# Altium schematic sheet BSPD+SDC.SchDoc (part 1 of 3)
size A0
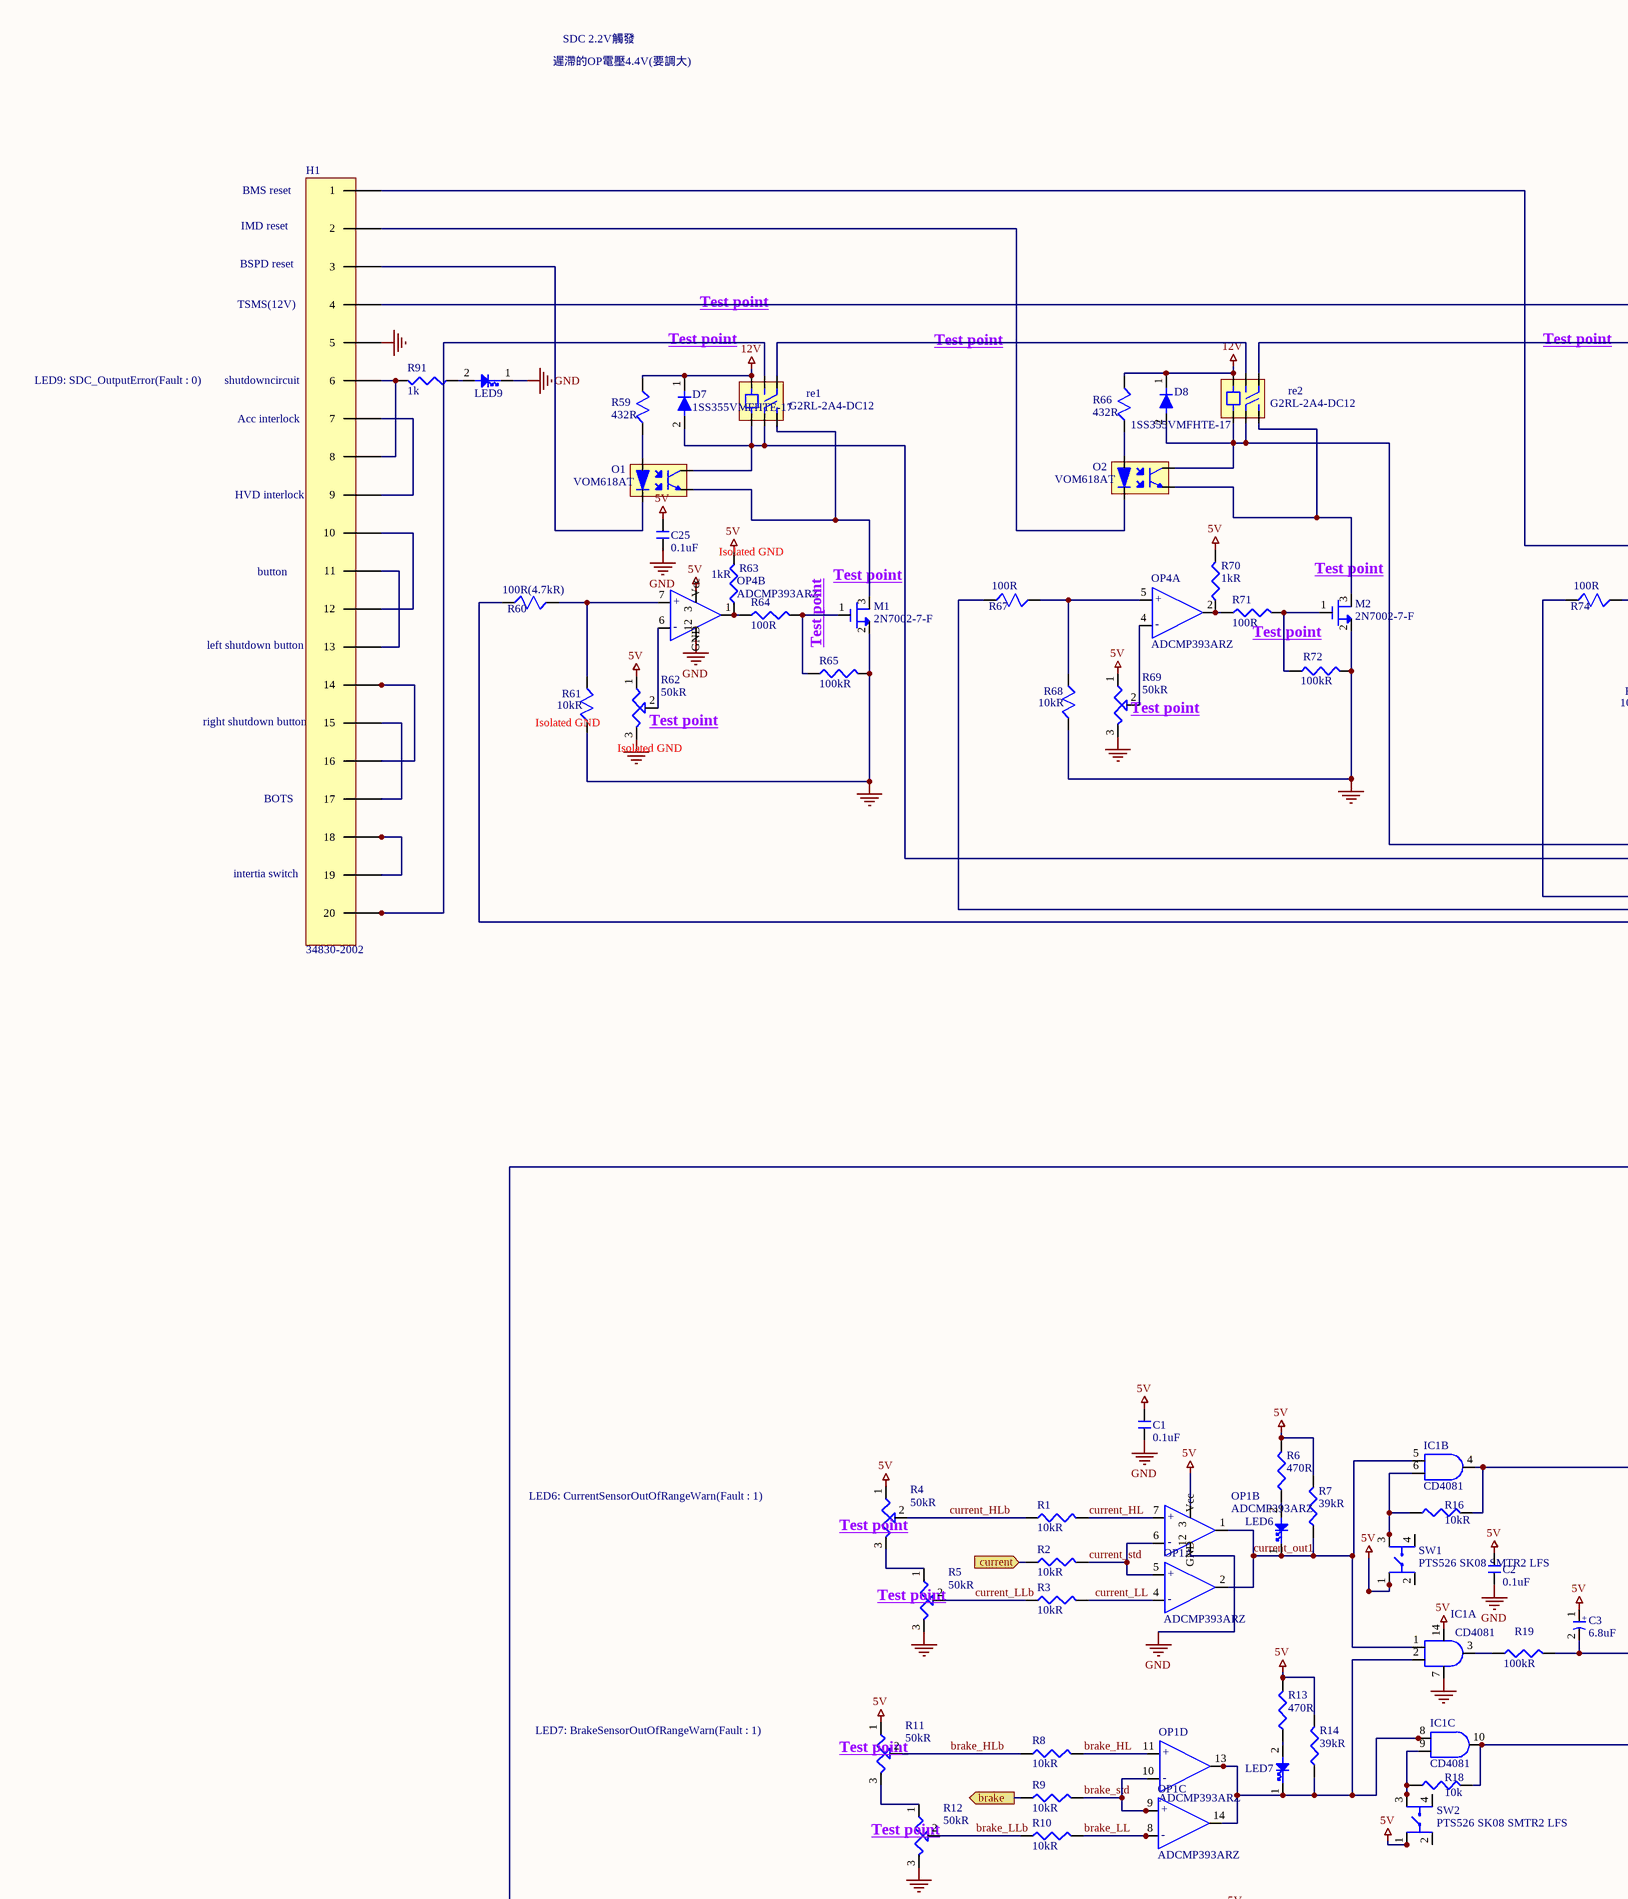
[diagram p0: BSPD+SDC.SchDoc, top left]
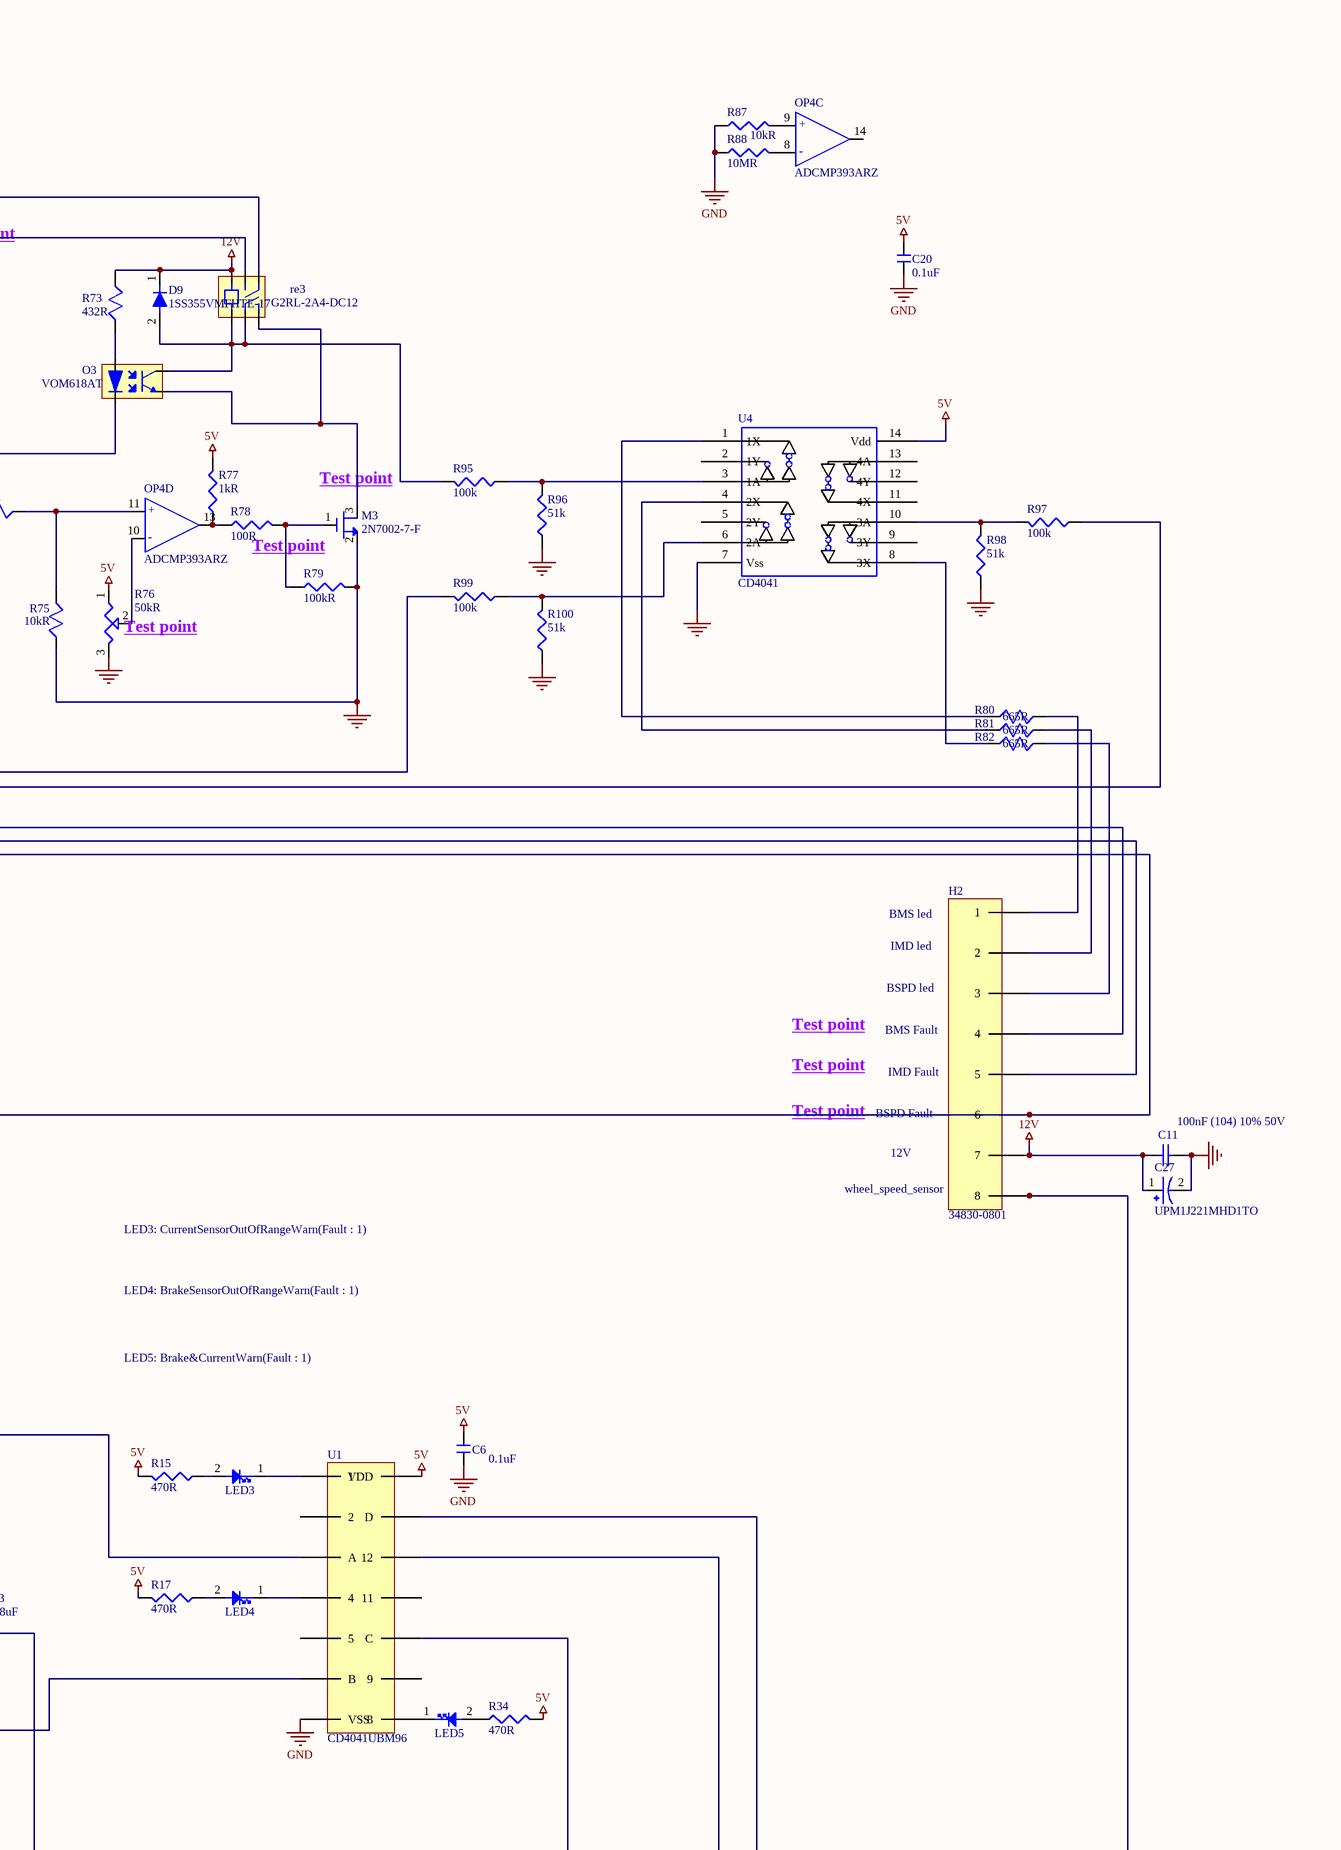
[diagram p1: BSPD+SDC.SchDoc, top right]
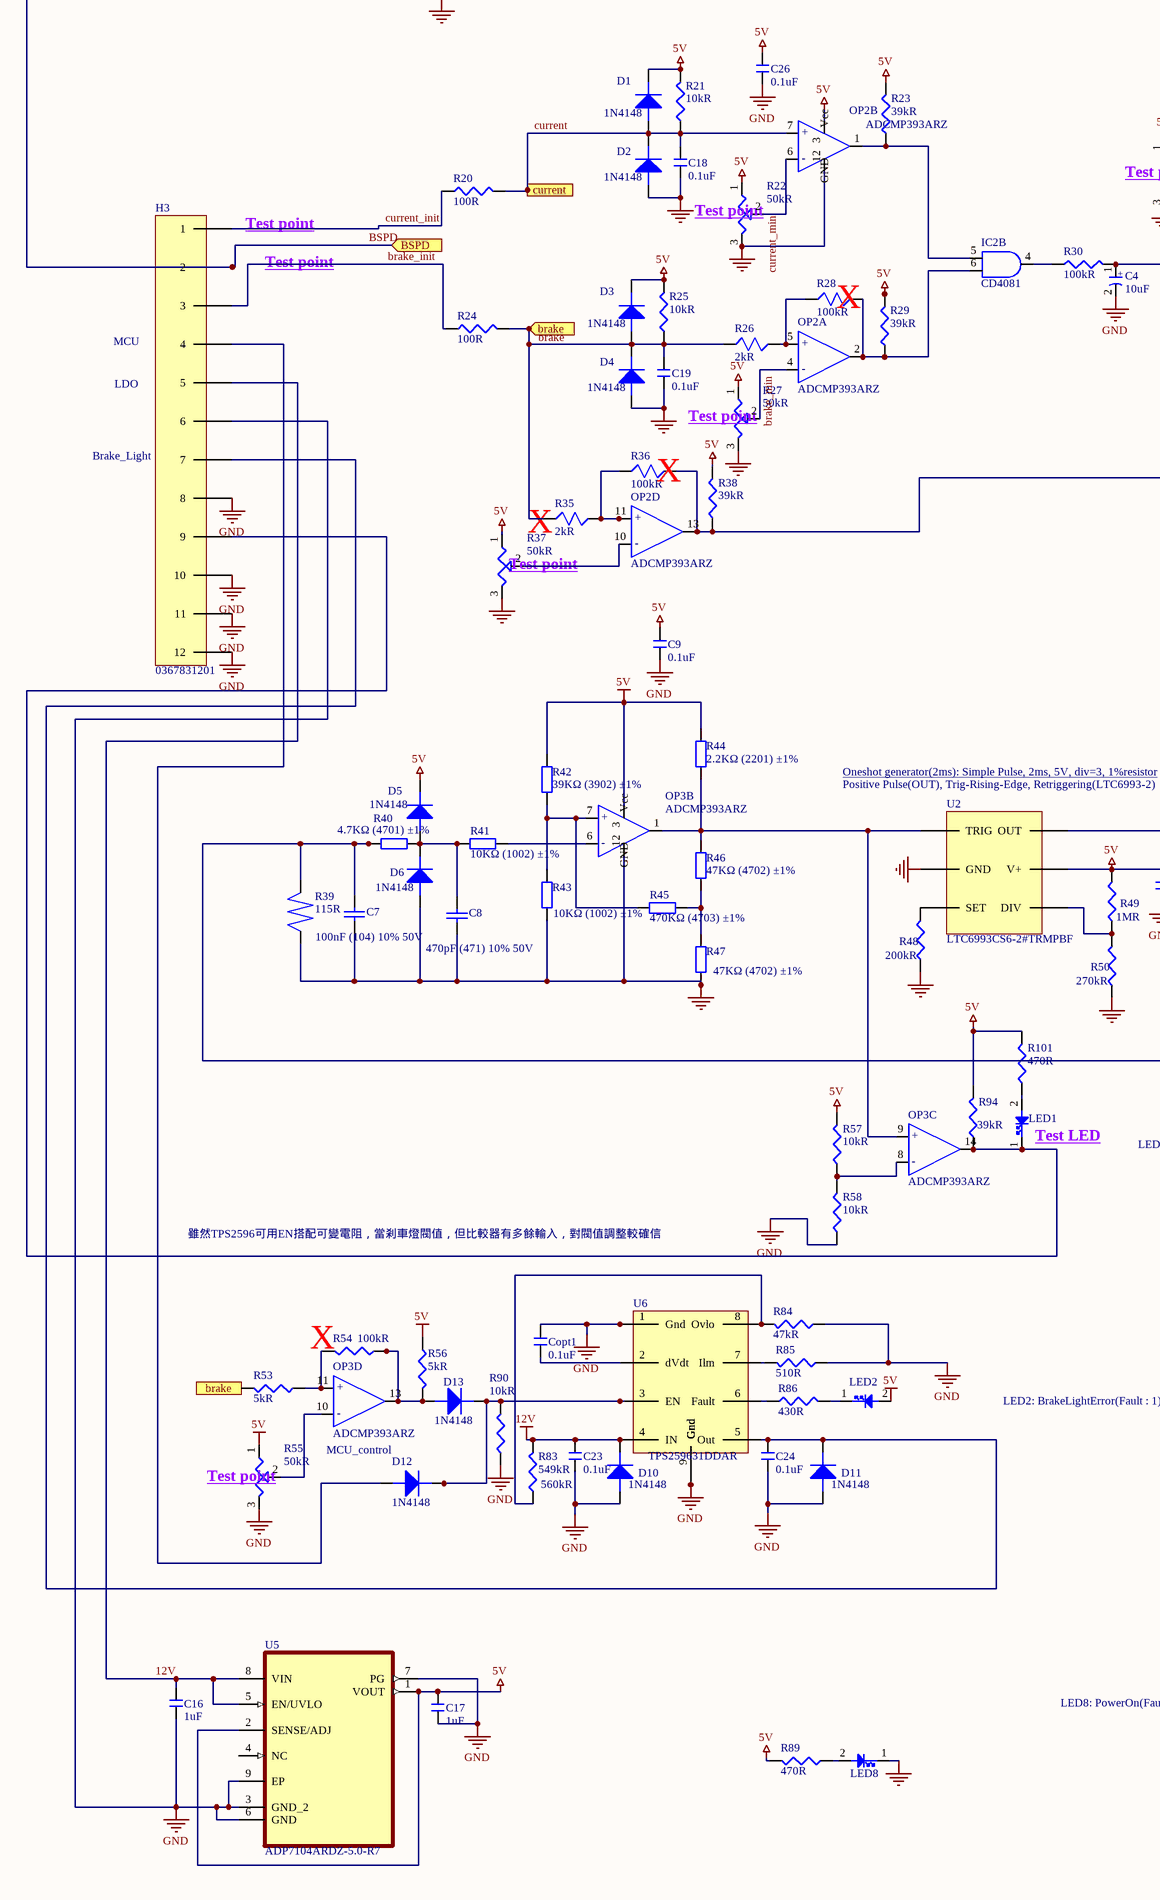
[diagram p2: BSPD+SDC.SchDoc, bottom left]
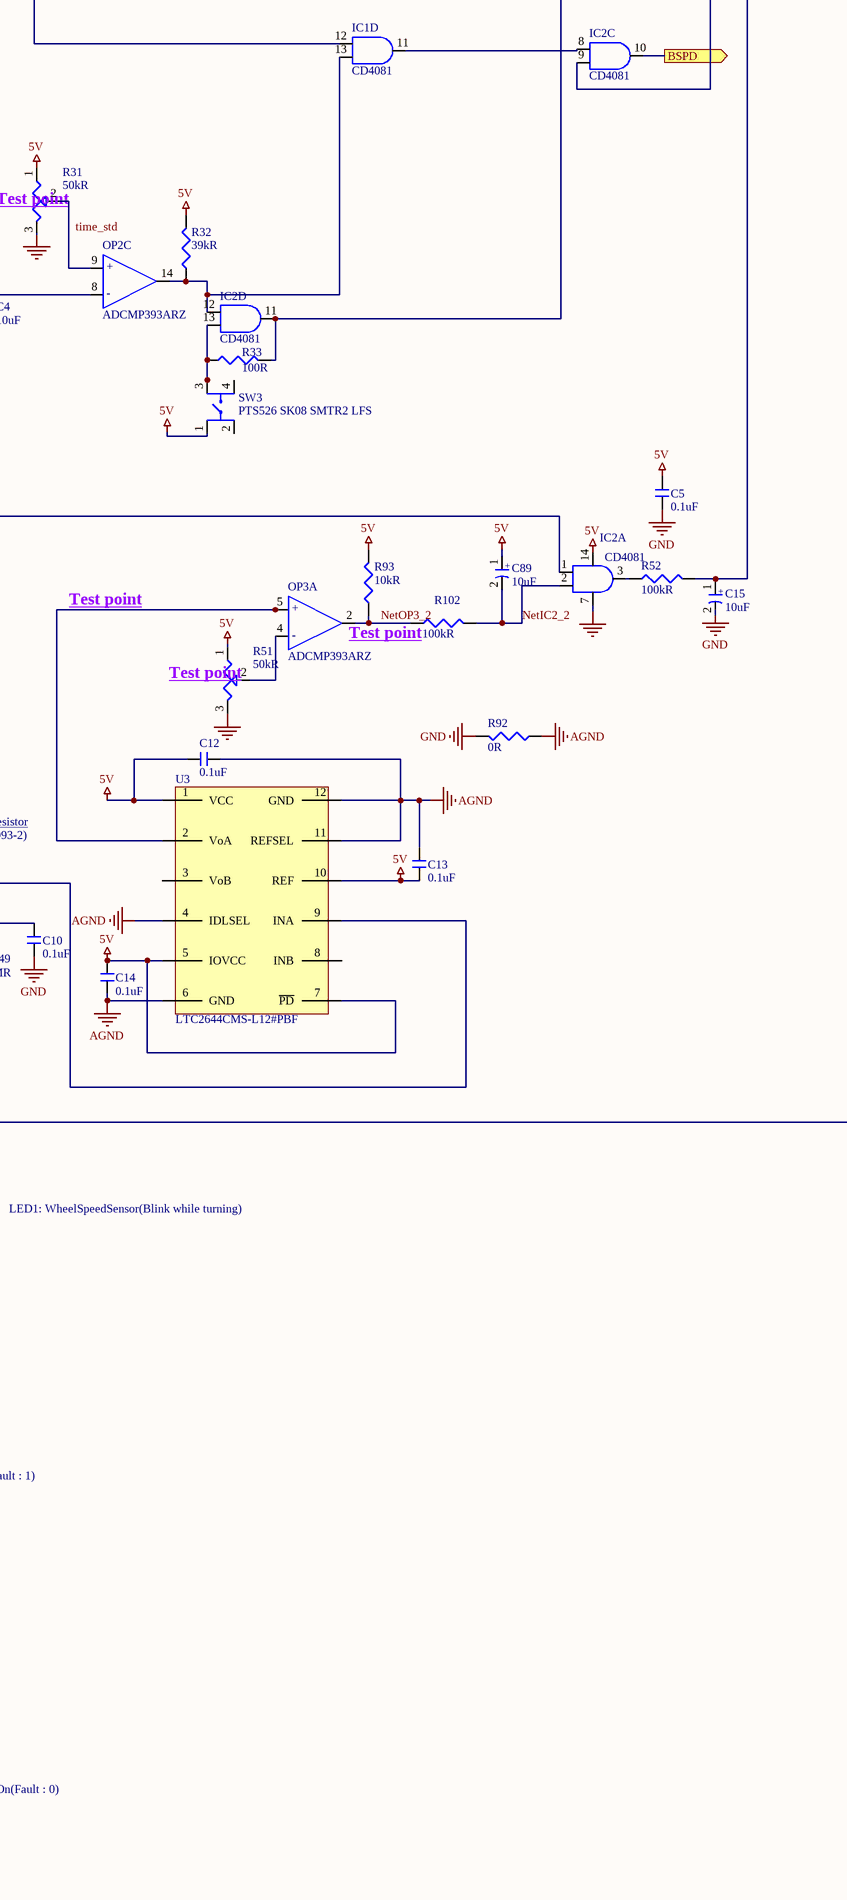
[diagram p3: BSPD+SDC.SchDoc, bottom right]

## Parts
C1  0.1uF  [0805-0.1uF-Capacitor]
C2  0.1uF  [0805-0.1uF-Capacitor]
C3  6.8uF  [2312-6.8uF-Capacitor]
C4  10uF  [2312-6.8uF-Capacitor]
C5  0.1uF  [0805-0.1uF-Capacitor]
C6  0.1uF  [0805-0.1uF-Capacitor]
C7  100nF (104) 10% 50V  [1206_C]
C8  470pF (471) 10% 50V  [1206_C]
C9  0.1uF  [0805-0.1uF-Capacitor]
C10  0.1uF  [0805-0.1uF-Capacitor]
C11  100nF (104) 10% 50V  [1206_C]
C12  0.1uF  [0805-0.1uF-Capacitor]
C13  0.1uF  [0805-0.1uF-Capacitor]
C14  0.1uF  [0805-0.1uF-Capacitor]
C15  10uF  [2312-6.8uF-Capacitor]
C16  1uF  [0805-0.47uF-CAPACITOR]
C17  1uF  [0805-0.47uF-CAPACITOR]
C18  0.1uF  [0805-0.1uF-Capacitor]
C19  0.1uF  [0805-0.1uF-Capacitor]
C20  0.1uF  [0805-0.1uF-Capacitor]
C23  0.1uF  [0805-0.1uF-Capacitor]
C24  0.1uF  [0805-0.1uF-Capacitor]
C25  0.1uF  [0805-0.1uF-Capacitor]
C26  0.1uF  [0805-0.1uF-Capacitor]
C27  UPM1J221MHD1TO  [CAPPRD500W60D1250H2200]
C89  10uF  [2312-6.8uF-Capacitor]
Copt1  0.1uF  [0805-0.1uF-Capacitor]
D1  1N4148  [1N4148W-TP]
D2  1N4148  [1N4148W-TP]
D3  1N4148  [1N4148W-TP]
D4  1N4148  [1N4148W-TP]
D5  1N4148  [1N4148W-TP]
D6  1N4148  [1N4148W-TP]
D7  1SS355VMFHTE-17  [1SS355VMFHTE-17]
D8  1SS355VMFHTE-17  [1SS355VMFHTE-17]
D9  1SS355VMFHTE-17  [1SS355VMFHTE-17]
D10  1N4148  [1N4148W-TP]
D11  1N4148  [1N4148W-TP]
D12  1N4148  [1N4148W-TP]
D13  1N4148  [1N4148W-TP]
H1  34830-2002  [348302002]
H2  34830-0801  [MOLEX_34830-0801]
H3  0367831201  [MOLEX_36783-1201]
IC1  CD4081  [CD4081BM]  (parts A,B,C,D of 4)
IC2  CD4081  [CD4081BM]  (parts A,B,C,D of 4)
LED1  led-150080RS75000  [led-0805]  (value not drawn)
LED2  led-150080RS75000  [led-0805]  (value not drawn)
LED3  led-150080RS75000  [led-0805]  (value not drawn)
LED4  led-150080RS75000  [led-0805]  (value not drawn)
LED5  led-150080RS75000  [led-0805]  (value not drawn)
LED6  led-150080RS75000  [led-0805]  (value not drawn)
LED7  led-150080RS75000  [led-0805]  (value not drawn)
LED8  led-150080RS75000  [led-0805]  (value not drawn)
LED9  led-150080RS75000  [led-0805]  (value not drawn)
M1  2N7002-7-F  [2N7002-7-F]
M2  2N7002-7-F  [2N7002-7-F]
M3  2N7002-7-F  [2N7002-7-F]
O1  VOM618AT  [VOM618AT]
O2  VOM618AT  [VOM618AT]
O3  VOM618AT  [VOM618AT]
OP1  ADCMP393ARZ  [SOIC127P600X175-14N]  (parts A,B,C,D of 4)
OP2  ADCMP393ARZ  [SOIC127P600X175-14N]  (parts A,B,C,D of 4)
OP3  ADCMP393ARZ  [SOIC127P600X175-14N]  (parts A,B,C,D of 4)
OP4  ADCMP393ARZ  [SOIC127P600X175-14N]  (parts A,B,C,D of 4)
R1  10kR  [0805-Resistor]
R2  10kR  [0805-Resistor]
R3  10kR  [0805-Resistor]
R4  50kR  [50kR-vertical]
R5  50kR  [50kR-vertical]
R6  470R  [0805-Resistor]
R7  39kR  [0805-Resistor]
R8  10kR  [0805-Resistor]
R9  10kR  [0805-Resistor]
R10  10kR  [0805-Resistor]
R11  50kR  [50kR-vertical]
R12  50kR  [50kR-vertical]
R13  470R  [0805-Resistor]
R14  39kR  [0805-Resistor]
R15  470R  [0805-Resistor]
R16  10kR  [0805-Resistor]
R17  470R  [0805-Resistor]
R18  10k  [0805-Resistor]
R19  100kR  [0805-Resistor]
R20  100R  [0805-Resistor]
R21  10kR  [0805-Resistor]
R22  50kR  [50kR-vertical]
R23  39kR  [0805-Resistor]
R24  100R  [0805-Resistor]
R25  10kR  [0805-Resistor]
R26  2kR  [2kR]
R27  50kR  [50kR-vertical]
R28  100kR  [Yageo 0805]
R29  39kR  [0805-Resistor]
R30  100kR  [0805-Resistor]
R31  50kR  [50kR-vertical]
R32  39kR  [0805-Resistor]
R33  100R  [0805-Resistor]
R34  470R  [0805-Resistor]
R35  2kR  [2kR]
R36  100kR  [Yageo 0805]
R37  50kR  [50kR-vertical]
R38  39kR  [0805-Resistor]
R39  115R  [Yageo 0805]
R40  4.7KΩ (4701) ±1%  [0805_R]
R41  10KΩ (1002) ±1%  [0805_R]
R42  39KΩ (3902) ±1%  [0805_R]
R43  10KΩ (1002) ±1%  [0805_R]
R44  2.2KΩ (2201) ±1%  [0805_R]
R45  470KΩ (4703) ±1%  [0805_R]
R46  47KΩ (4702) ±1%  [0805_R]
R47  47KΩ (4702) ±1%  [0805_R]
R48  200kR  [0805-Resistor]
R49  1MR  [0805-Resistor]
R50  270kR  [0805-Resistor]
R51  50kR  [50kR-vertical]
R52  100kR  [0805-Resistor]
R53  5kR  [0805-Resistor]
R54  100kR  [0805-Resistor]
R55  50kR  [50kR-vertical]
R56  5kR  [0805-Resistor]
R57  10kR  [0805-Resistor]
R58  10kR  [0805-Resistor]
R59  432R  [432R]
R60  100R(4.7kR)  [4.99kR]
R61  10kR  [Yageo 0805]
R62  50kR  [50kR-vertical]
R63  1kR  [0805-Resistor]
R64  100R  [0805-Resistor]
R65  100kR  [0805-Resistor]
R66  432R  [432R]
R67  100R  [4.99kR]
R68  10kR  [Yageo 0805]
R69  50kR  [50kR-vertical]
R70  1kR  [0805-Resistor]
R71  100R  [0805-Resistor]
R72  100kR  [0805-Resistor]
R73  432R  [432R]
R74  100R  [4.99kR]
R75  10kR  [Yageo 0805]
R76  50kR  [50kR-vertical]
R77  1kR  [0805-Resistor]
R78  100R  [0805-Resistor]
R79  100kR  [0805-Resistor]
R80  665R  [665R,499R]
R81  665R  [665R,499R]
R82  665R  [665R,499R]
R83  549kR  [0805-Resistor]
R84  47kR  [0805-Resistor]
R85  510R  [0805-Resistor]
R86  430R  [0805-Resistor]
R87  10kR  [0805-Resistor]
R88  10MR  [0805-Resistor]
R89  470R  [0805-Resistor]
R90  10kR  [0805-Resistor]
R91  1k  [0805-Resistor]
R92  0R  [0805-Resistor]
R93  10kR  [0805-Resistor]
R94  39kR  [0805-Resistor]
R95  100k  [0805-Resistor]
R96  51k  [0805-Resistor]
R97  100k  [0805-Resistor]
R98  51k  [0805-Resistor]
R99  100k  [0805-Resistor]
R100  51k  [0805-Resistor]
R101  470R  [0805-Resistor]
R102  100kR  [0805-Resistor]
re1  G2RL-2A4-DC12  [G2RL-2A4-DC12]
re2  G2RL-2A4-DC12  [G2RL-2A4-DC12]
re3  G2RL-2A4-DC12  [G2RL-2A4-DC12]
SW1  PTS526 SK08 SMTR2 LFS  [PTS526SKG15SMTR2LFS]
SW2  PTS526 SK08 SMTR2 LFS  [PTS526SKG15SMTR2LFS]
SW3  PTS526 SK08 SMTR2 LFS  [PTS526SKG15SMTR2LFS]
U1  CD4041UBM96  [SOIC127P600X175-14N]
U2  LTC6993CS6-2#TRMPBF  [TSOT-23_S6]
U3  LTC2644CMS-L12#PBF  [SOP65P490X110-12N]
U4  CD4041  [SOIC127P600X175-14N]
U5  ADP7104ARDZ-5.0-R7  [SOIC127P600X175-9N]
U6  TPS259631DDAR  [VREG_LM5017MR/NOPB]

## Ports
brake (in), brake (out), BSPD (in), BSPD (out), current (in), current (out)

## Nets
5V: C1.2 C2.2 C3.1(+) C5.2 C6.2 C9.2 C10.2 C12.2 C13.2 C14.2 C17.2 C20.2 C25.2 C26.2 C89.1(+) D1.1(-) D3.1(-) D5.1(-) IC1.14(Vcc) IC2.14(Vcc) LED2.2 OP1.3(Vcc) OP2.3(Vcc) OP3.3(Vcc) OP4.3(Vcc) R4.1 R6.2 R7.2 R11.1 R13.2 R14.2 R15.2 R17.2 R21.2 R22.1 R23.2 R25.2 R27.1 R29.2 R31.1 R32.2 R34.2 R37.1 R38.2 R42.2 R44.2 R49.2 R51.1 R55.1 R56.1 R57.2 R62.1 R63.2 R69.1 R70.2 R76.1 R77.2 R89.2 R93.2 R94.2 R101.2 SW1.1 SW2.1 SW3.1 U1.14(VDD) U2.5(V+) U3.1(VCC) U3.5(IOVCC) U3.7(~{PD}) U3.10(REF) U4.14(Vdd) U5.1(VOUT) U5.2(SENSE/ADJ)
12V: C11.2 C16.2 C23.2 C27.1(P) D7.1 D8.1 D9.1 D10.1(-) H2.7 H3.5 R59.2 R66.2 R73.2 R83.2 re1.8 re2.8 re3.8 U5.5(EN/UVLO) U5.8(VIN) U6.4(IN)
AGND: C12.1 C13.1 C14.1 R92.1 U3.4(IDLSEL) U3.6(GND) U3.11(REFSEL) U3.12(GND)
GND: C1.1 C2.1 C4.2(-) C5.1 C6.1 C7.1 C8.1 C9.1 C10.1 C11.1 C15.2(-) C16.1 C17.1 C18.1 C19.1 C20.1 C23.1 C24.1 C25.1 C26.1 C27.2(N) Copt1.1 D2.2(+) D4.2(+) D6.2(+) D10.2(+) D11.2(+) H1.5 H3.6 H3.8 H3.10 H3.11 H3.12 IC1.7(GND) IC2.7(GND) LED8.1 LED9.1 M1.2 M2.2 M3.2 OP1.12(GND) OP2.12(GND) OP3.12(GND) OP4.12(GND) R5.3 R12.3 R22.3 R27.3 R31.3 R37.3 R39.1 R43.1 R47.1 R48.1 R50.1 R51.3 R55.3 R58.1 R61.1 R62.3 R65.2 R68.1 R69.3 R72.2 R75.1 R76.3 R79.2 R84.1 R85.1 R87.1 R88.1 R90.1 R92.2 R96.1 R98.1 R100.1 U1.7(VSS) U2.2(GND) U4.7(Vss) U5.3(GND_2) U5.6(GND) U5.7(PG) U5.9(EP) U6.1(Gnd) U6.9(Gnd) U6.10(Gnd) U6.11(Gnd) U6.12(Gnd) U6.13(Gnd) U6.14(Gnd) U6.15(Gnd) U6.16(Gnd) U6.17(Gnd)
brake: C19.2 D3.2(+) D4.1(-) R9.1 R24.2 R25.1 R26.1 R35.1 R53.2 ; port brake
brake_HL: OP1.11(+) R8.2
brake_HLb: R8.1 R11.2
brake_init: H3.3 R24.1
brake_LL: OP1.8(-) R10.2
brake_LLb: R10.1 R12.2
brake_min: OP2.4(-) R27.2
brake_std: OP1.9(+) OP1.10(-) R9.2
BSPD: H2.6 H3.2 IC2.10(out) R60.1 ; port BSPD
current: C18.2 D1.2(+) D2.1(-) OP2.7(+) R2.1 R20.2 R21.1 ; port current
current_HL: OP1.7(+) R1.2
current_HLb: R1.1 R4.2
current_init: H3.1 R20.1
current_LL: OP1.4(-) R3.2
current_LLb: R3.1 R5.2
current_min: OP2.6(-) R22.2
current_out1: IC1.1(in) IC1.5(in) LED6.1 OP1.1(out) OP1.2(out) R7.1
current_std: OP1.5(+) OP1.6(-) R2.2
NetIC2_2: C89.2(-) IC2.2(in) R102.2
NetOP3_2: OP3.2(out) R93.1 R102.1
NetC3_2: C3.2(-) IC1.12(in) R19.2
NetC4_1: C4.1(+) OP2.8(-) R30.2
NetC7_2: C7.2 H2.8 R39.2 R40.1
NetC8_2: C8.2 D5.2(+) D6.1(-) R40.2 R41.1
NetC15_1: C15.1(+) R52.2 U1.13(D)
NetC24_2: C24.2 D11.1(-) H3.7 U6.5(Out)
NetCopt1_2: Copt1.2 U6.2(dVdt)
NetD7_2: D7.2 O1.4 R97.1 re1.1 re1.3
NetD8_2: D8.2 O2.4 R99.2 re2.1 re2.3
NetD9_2: D9.2 O3.4 R95.2 re3.1 re3.3
NetD12_1: D12.1(-) D13.1(-) R90.2 U6.3(EN)
NetD12_2: D12.2(+) H3.4
NetD13_2: D13.2(+) OP3.13(out) R54.1 R56.2
NetH1_1: H1.1 O3.2
NetH1_2: H1.2 O2.2
NetH1_3: H1.3 O1.2
NetH1_4: H1.4 re3.5
NetH1_6: H1.6 H1.8 R91.2
NetH1_7: H1.7 H1.9
NetH1_10: H1.10 H1.12
NetH1_11: H1.11 H1.13
NetH1_14: H1.14 H1.16
NetH1_15: H1.15 H1.17
NetH1_18: H1.18 H1.19
NetH1_20: H1.20 re1.6
NetH2_1: H2.1 R80.1
NetH2_2: H2.2 R81.1
NetH2_3: H2.3 R82.1
NetH2_4: H2.4 R74.1
NetH2_5: H2.5 R67.1
NetH3_9: H3.9 LED1.1 OP3.14(out) R94.1
NetIC1_2: IC1.2(in) IC1.8(in) LED7.1 OP1.13(out) OP1.14(out) R14.1
NetIC1_3: IC1.3(out) R19.1
NetIC1_4: IC1.4(out) R16.2 U1.3(A)
NetIC1_6: IC1.6(in) R16.1 SW1.3
NetIC1_9: IC1.9(in) R18.1 SW2.3
NetIC1_10: IC1.10(out) R18.2 U1.6(B)
NetIC1_11: IC1.11(out) IC2.8(in)
NetIC1_13: IC1.13(in) IC2.12(in) OP2.14(out) R32.1
NetIC2_1: IC2.1(in) OP2.13(out) R36.2 R38.1
NetIC2_3: IC2.3(out) R52.1
NetIC2_4: IC2.4(out) R30.1
NetIC2_5: IC2.5(in) OP2.1(out) R23.1
NetIC2_6: IC2.6(in) OP2.2(out) R28.2 R29.1
NetIC2_9: IC2.9(in) U1.12
NetIC2_11: IC2.11(out) R33.2 U1.10(C)
NetIC2_13: IC2.13(in) R33.1 SW3.3
NetLED1_2: LED1.2 R101.1
NetLED2_1: LED2.1 R86.2
NetLED3_1: LED3.1 U1.1
NetLED3_2: LED3.2 R15.1
NetLED4_1: LED4.1 U1.4
NetLED4_2: LED4.2 R17.1
NetLED5_1: LED5.1 U1.8
NetLED5_2: LED5.2 R34.1
NetLED6_2: LED6.2 R6.1
NetLED7_2: LED7.2 R13.1
NetLED8_2: LED8.2 R89.1
NetLED9_2: LED9.2 R91.1
NetM1_1: M1.1 R64.2 R65.1
NetM1_3: M1.3 O1.3 re1.4
NetM2_1: M2.1 R71.2 R72.1
NetM2_3: M2.3 O2.3 re2.4
NetM3_1: M3.1 R78.2 R79.1
NetM3_3: M3.3 O3.3 re3.4
NetO1_1: O1.1 R59.1
NetO2_1: O2.1 R66.1
NetO3_1: O3.1 R73.1
NetOP2_5: OP2.5(+) R26.2 R28.1
NetOP2_9: OP2.9(+) R31.2
NetOP2_10: OP2.10(-) R37.2
NetOP2_11: OP2.11(+) R35.2 R36.1
NetOP3_1: OP3.1(out) OP3.9(+) R44.1 R46.2 U2.1(TRIG)
NetOP3_4: OP3.4(-) R51.2
NetOP3_5: OP3.5(+) U3.2(VoA)
NetOP3_6: OP3.6(-) R41.2
NetOP3_7: OP3.7(+) R42.1 R43.2 R45.2
NetOP3_8: OP3.8(-) R57.1 R58.2
NetOP3_10: OP3.10(-) R55.2
NetOP3_11: OP3.11(+) R53.1 R54.2
NetOP4_1: OP4.1(out) R63.1 R64.1
NetOP4_2: OP4.2(out) R70.1 R71.1
NetOP4_4: OP4.4(-) R69.2
NetOP4_5: OP4.5(+) R67.2 R68.2
NetOP4_6: OP4.6(-) R62.2
NetOP4_7: OP4.7(+) R60.2 R61.2
NetOP4_8: OP4.8(-) R88.2
NetOP4_9: OP4.9(+) R87.2
NetOP4_10: OP4.10(-) R76.2
NetOP4_11: OP4.11(+) R74.2 R75.2
NetOP4_13: OP4.13(out) R77.1 R78.1
NetR4_3: R4.3 R5.1
NetR11_3: R11.3 R12.1
NetR45_1: R45.1 R46.1 R47.2
NetR48_2: R48.2 U2.3(SET)
NetR49_1: R49.1 R50.2 U2.4(DIV)
NetR80_2: R80.2 U4.1(1X)
NetR81_2: R81.2 U4.4(2X)
NetR82_2: R82.2 U4.8(3X)
NetR83_1: R83.1 R84.2 U6.8(Ovlo)
NetR85_2: R85.2 U6.7(Ilm)
NetR86_1: R86.1 U6.6(Fault)
NetR95_1: R95.1 R96.2 U4.3(1A)
NetR97_2: R97.2 R98.2 U4.10(3A)
NetR99_1: R99.1 R100.2 U4.6(2A)
Netre1_5: re1.5 re2.6
Netre2_5: re2.5 re3.6
NetU2_6: U2.6(OUT) U3.9(INA)

Not connected (* = marked no-connect by the designer): OP4 14(out); SW1 2 4; SW2 2 4; SW3 2 4; U1 2 5 9 11; U3 3(VoB) 8(INB); U4 2(1Y) 5(2Y) 9(3Y) 11(4X) 12(4Y) 13(4A); U5 4(NC)

## Notes on the sheet
- SDC 2.2V觸發
- 遲滯的OP電壓4.4V(要調大)
- IMD reset
- (near H1) BMS reset
- (near H1) BSPD reset
- TSMS(12V)
- Test point
- LED9: SDC_OutputError(Fault : 0)
- (near H1) shutdowncircuit
- (near H1) Acc interlock
- (near H1) HVD interlock
- (near R63) Isolated GND
- button
- (near M1) Test point
- (near M2) Test point
- (near M3) Test point
- (near H1) left shutdown button
- (near H1) right shutdown button
- (near R61) Isolated GND
- (near R62) Isolated GND
- (near R62) Test point
- (near R69) Test point
- (near R76) Test point
- BOTS
- (near H1) intertia switch
- BMS led
- BSPD led
- IMD led
- (near H2) BMS Fault
- (near H2) IMD Fault
- (near H2) BSPD Fault
- (near H2) wheel_speed_sensor
- 12V
- LED3: CurrentSensorOutOfRangeWarn(Fault : 1)
- LED4: BrakeSensorOutOfRangeWarn(Fault : 1)
- LED5: Brake&CurrentWarn(Fault : 1)
- LED6: CurrentSensorOutOfRangeWarn(Fault : 1)
- (near R4) Test point
- (near R5) Test point
- LED7: BrakeSensorOutOfRangeWarn(Fault : 1)
- (near R11) Test point
- (near R12) Test point
- (near R31) Test point
- (near R22) Test point
- (near R28) X
- MCU
- LDO
- (near H3) Brake_Light
- (near R27) Test point
- X
- (near R36) X
- (near R37) Test point
- (near R102) Test point
- (near R51) Test point
- Oneshot generator(2ms): Simple Pulse, 2ms, 5V, div=3, 1%resistor <http://beta-tools.analog.com/timerblox/LTC6993>
- (near U2) Positive Pulse(OUT), Trig-Rising-Edge, Retriggering(LTC6993-2)
- (near LED1) Test LED
- LED1: WheelSpeedSensor(Blink while turning)
- 雖然TPS2596可用EN搭配可變電阻，當剎車燈閥值，但比較器有多餘輸入，對閥值調整較確信
- (near R54) X
- LED2: BrakeLightError(Fault : 1)
- (near R55) Test point
- MCU_control
- (near R83) 560kR
- LED8: PowerOn(Fault : 0)
- Labels drawn without touching a wire or pin: brake, time_std